# EAGLE design fancontrol (EAGLE 6.3)
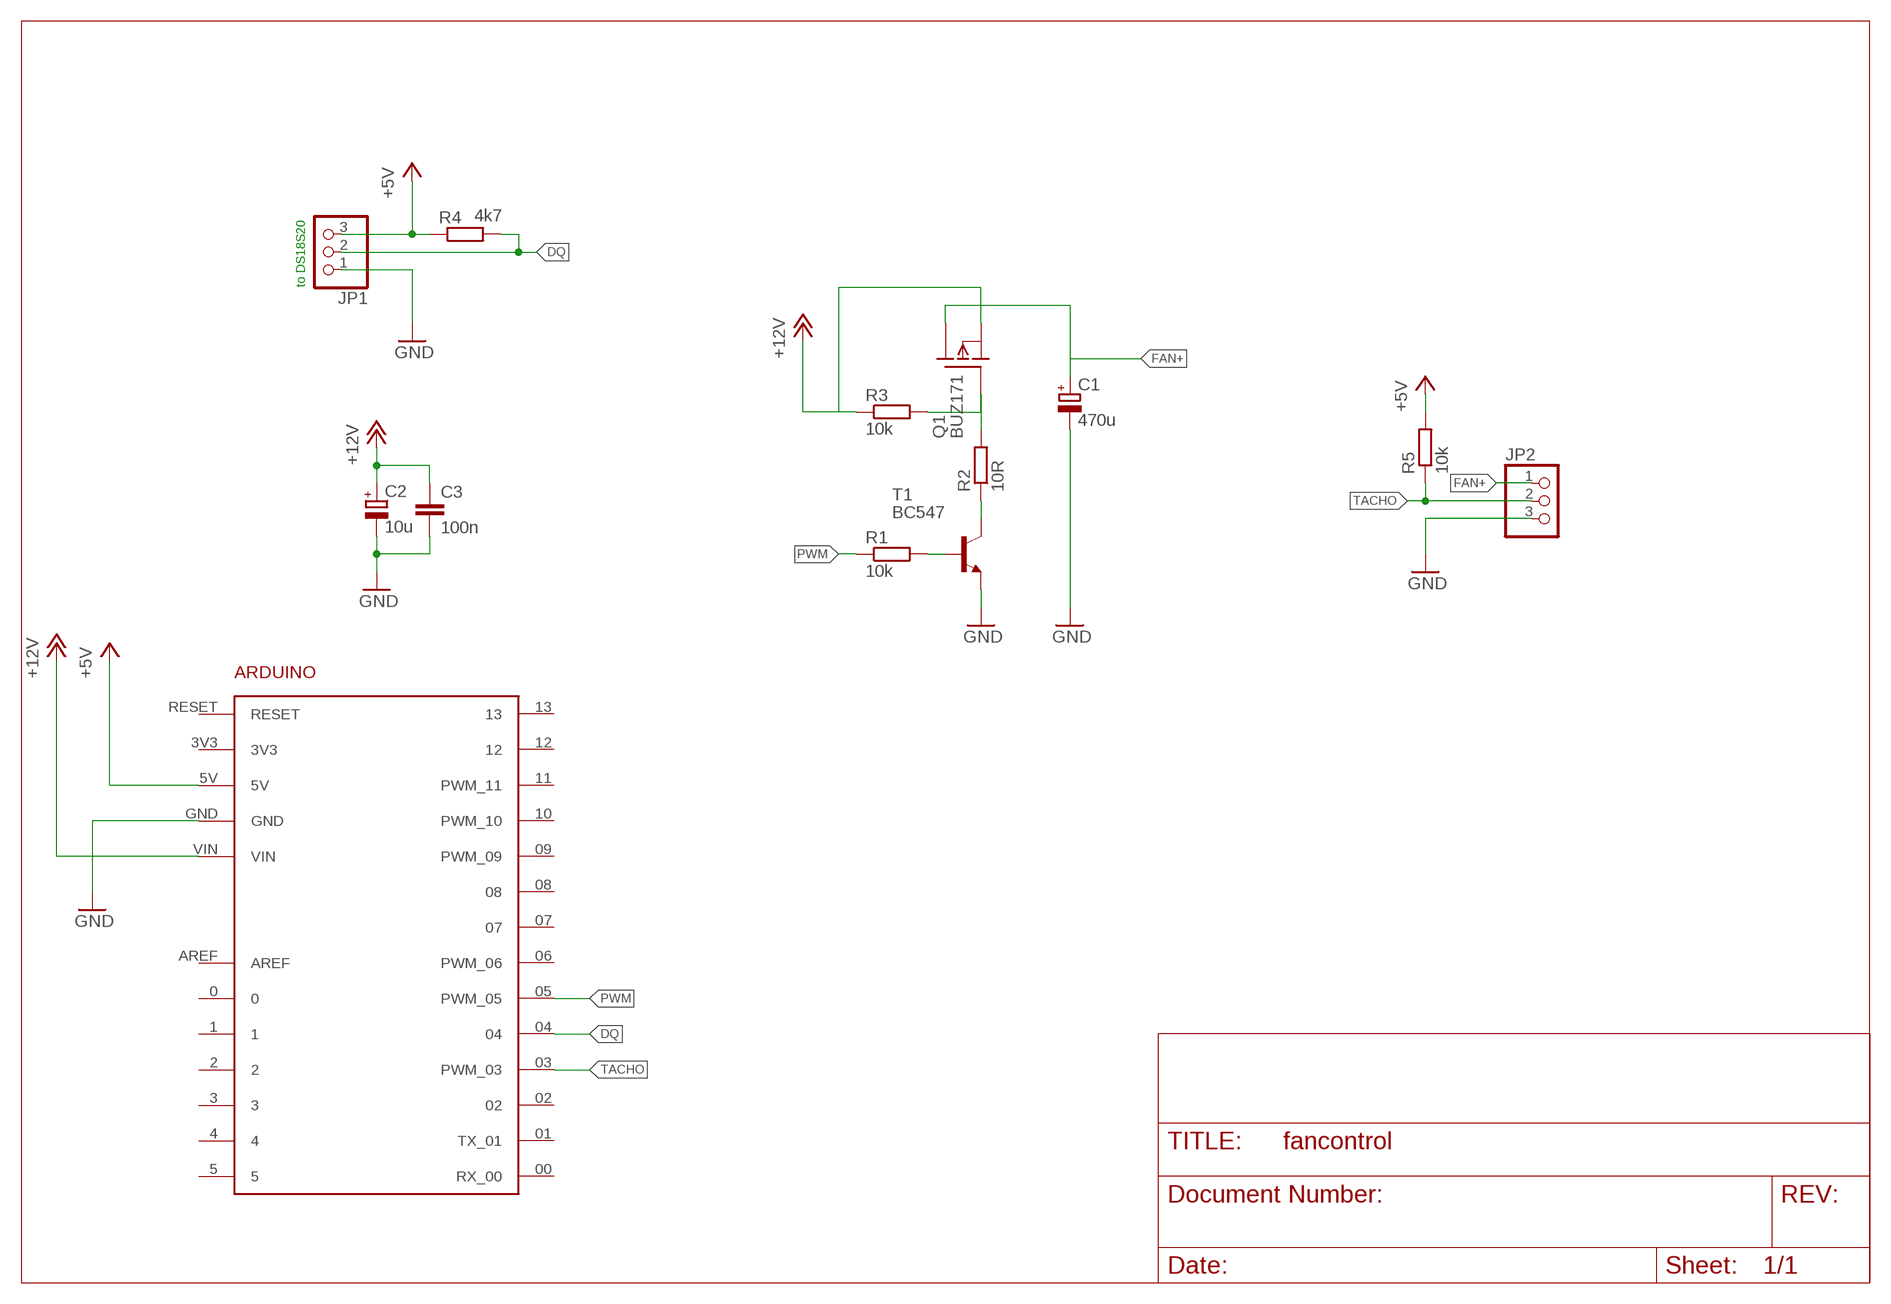
[diagram p0: schematic, sheet 1]

## Parts
ARDUINO1  ARDUINO  [ARDUINO]
C1  470u  CPOL-EUE5-10.5  [E5-10,5]
C2  10u  CPOL-EUE2.5-5  [E2,5-5]
C3  100n  C-EU025-025X050  [C025-025X050]
JP1  PINHD-1X3  [1X03]
JP2  PINHD-1X3  [1X03]
Q1  BUZ171  [TO220]
R1  10k  R-EU_0207/7  [0207/7]
R2  10R  R-EU_0207/7  [0207/7]
R3  10k  R-EU_0207/7  [0207/7]
R4  4k7  R-EU_0207/7  [0207/7]
R5  10k  R-EU_0207/7  [0207/7]
T1  BC547  [TO92]

## Nets
+5V: ARDUINO1.5V JP1.3 R4.1 R5.2
+12V: ARDUINO1.VIN C2.+ C3.1 Q1.3(S) R3.1
DQ: ARDUINO1.04 JP1.2 R4.2
FAN+: C1.+ JP2.1 Q1.2(D)
GND: ARDUINO1.GND C1.- C2.- C3.2 JP1.1 JP2.3 T1.1(E)
N$1: R1.2 T1.2(B)
N$2: R2.1 T1.3(C)
N$3: Q1.1(G) R2.2 R3.2
PWM: ARDUINO1.05(PWM_05) R1.1
TACHO: ARDUINO1.03(PWM_03) JP2.2 R5.1
Unconnected: ARDUINO1.0 ARDUINO1.00(RX_00) ARDUINO1.1 ARDUINO1.01(TX_01) ARDUINO1.02 ARDUINO1.2 ARDUINO1.3 ARDUINO1.3V3 ARDUINO1.4 ARDUINO1.5 ARDUINO1.06(PWM_06) ARDUINO1.07 ARDUINO1.08 ARDUINO1.09(PWM_09) ARDUINO1.10(PWM_10) ARDUINO1.11(PWM_11) ARDUINO1.12 ARDUINO1.13 ARDUINO1.AREF ARDUINO1.RESET

## Notes on the sheet
- to DS18S20

## Library data of the parts
ARDUINO1 = arduino:ARDUINO: For creating Arduino shields
C1 C2 = rcl:CPOL-EU: POLARIZED CAPACITOR, European symbol
C3 = rcl:C-EU: CAPACITOR, European symbol
JP1 JP2 = pinhead:PINHD-1X3: PIN HEADER
Q1 = transistor-fet:BUZ171: P-Channel Enhancement MOSFET -50V; 7A; 0,4Ohm
R1-R5 = rcl:R-EU_: RESISTOR, European symbol
T1 = transistor:BC547: NPN TRANSISTOR

## Board
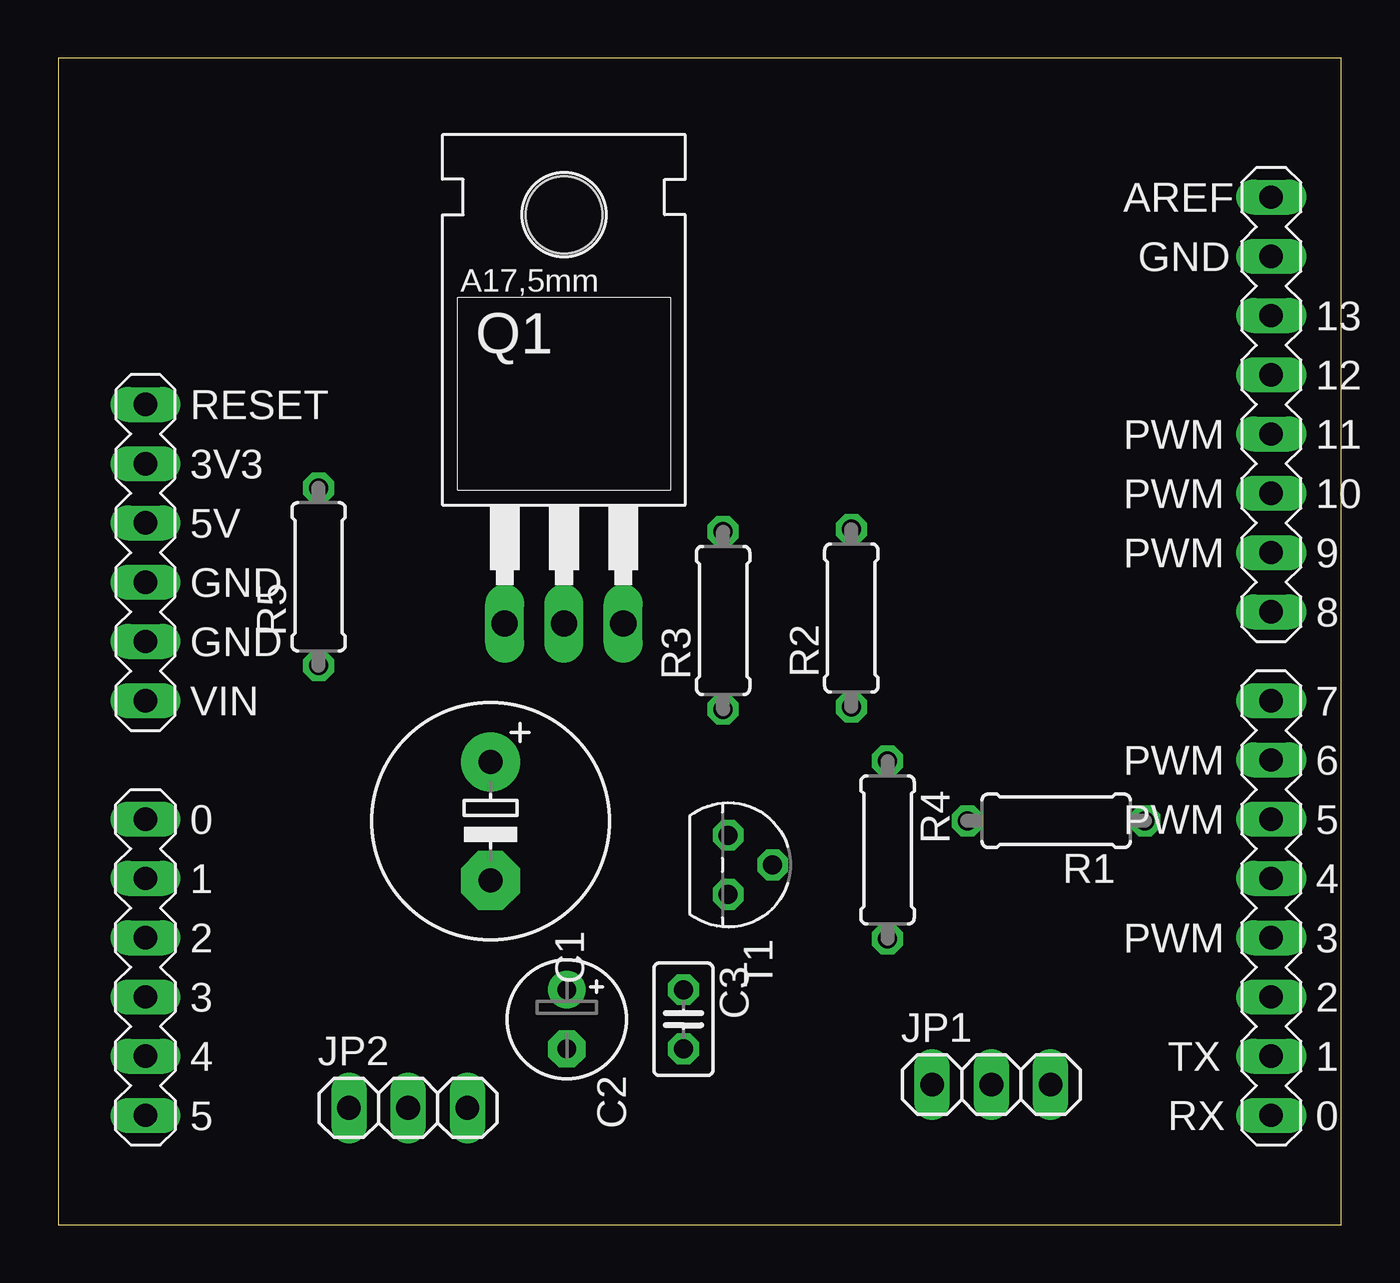
[diagram p1: board, top side]
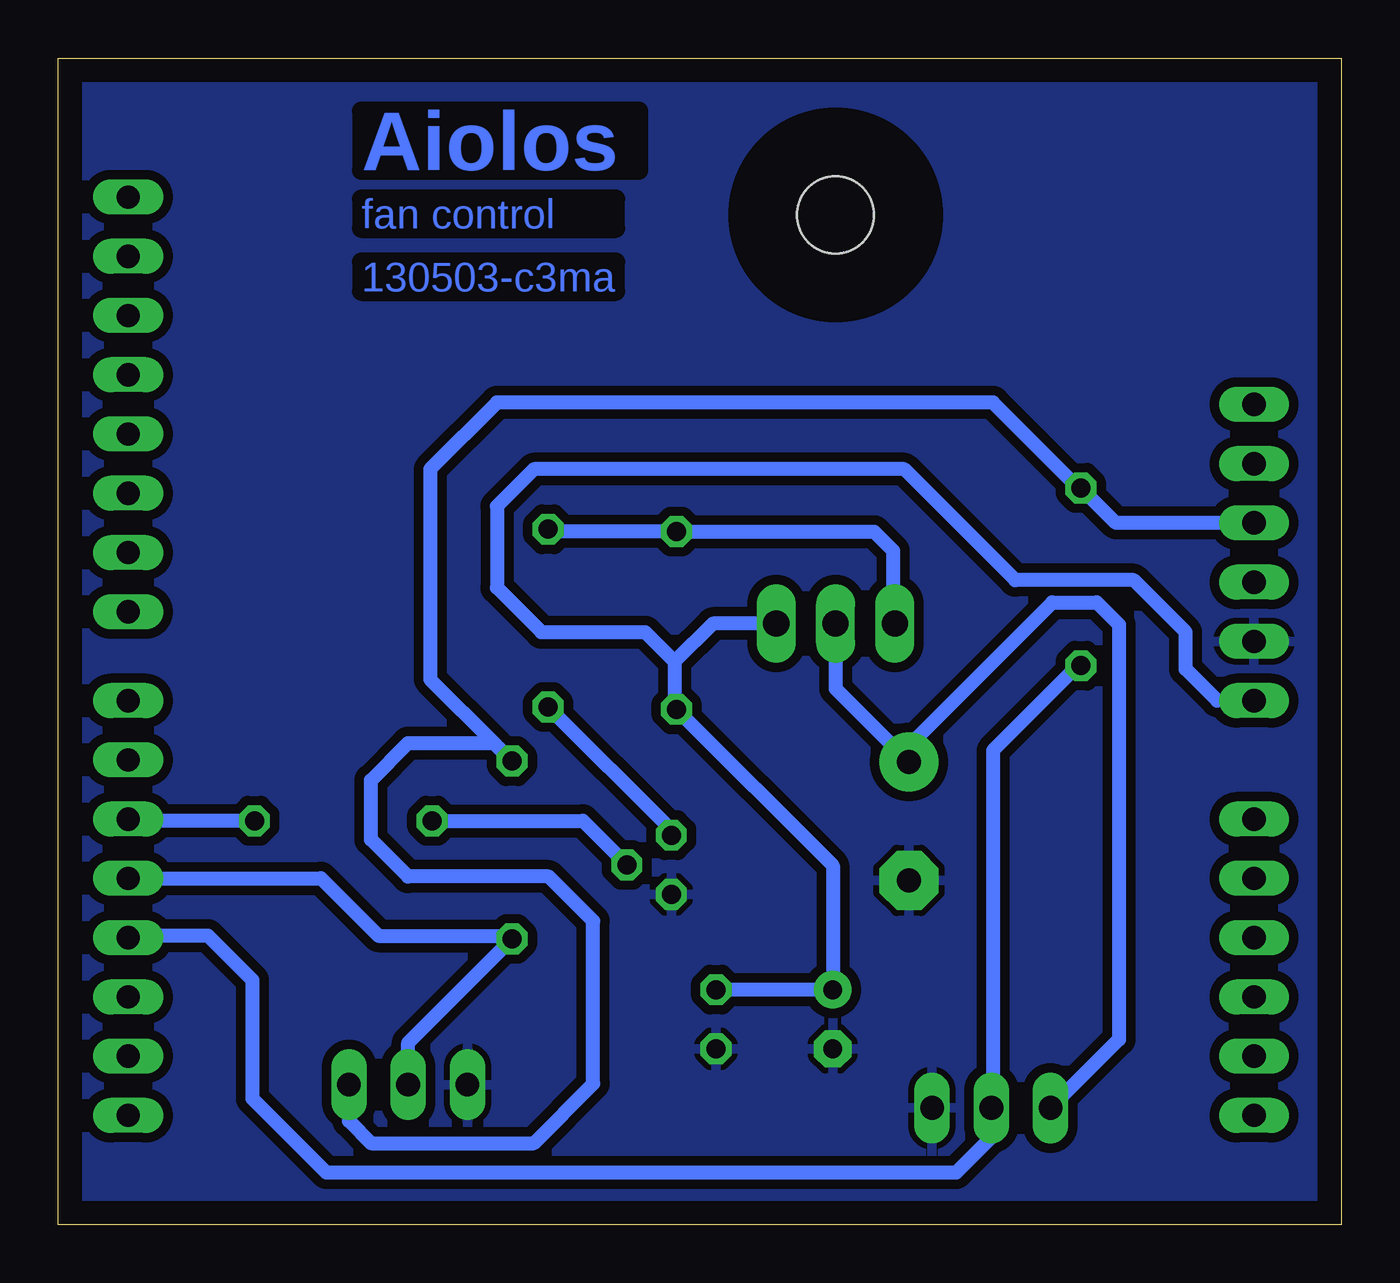
[diagram p2: board, bottom side, seen from below]

Size 55 x 50 mm. Coordinates in mm from the lower left corner, seen from the top.
Outline: 0,0 55,0 55,50 0,50 0,0
Copper layers (1*16): Top 0.035mm / dielectric 1.5mm / Bottom 0.035mm
Design rules "default": minimum track width 10mil, minimum drill 24mil, track to track 8mil, track to pad 8mil, pad to pad 8mil, via to via 8mil, smd to smd 8mil, copper to edge 40mil, drill to drill 8mil, minimum pad ring 10mil, minimum via ring 8mil, stop-mask expansion 4mil, vias tented up to drill 0mil, thermal gap 10mil

### Footprints (pad centres in the part's own frame; a part is rotated, then mirrored left to right if it is on the bottom)
ARDUINO = drill 1 long: 00 25.4,-20.32; 0 -22.86,-7.62; 01 25.4,-17.78; 1 -22.86,-10.16; 02 25.4,-15.24; 2 -22.86,-12.7; 03 25.4,-12.7; 3 -22.86,-15.24; 3V3 -22.86,7.62; 04 25.4,-10.16; 4 -22.86,-17.78; 05 25.4,-7.62; 5 -22.86,-20.32; 5V -22.86,5.08; 06 25.4,-5.08; 07 25.4,-2.54; 08 25.4,1.27; 09 25.4,3.81; 10 25.4,6.35; 11 25.4,8.89; 12 25.4,11.43; 13 25.4,13.97; AREF 25.4,19.05; GND -22.86,0; GND2 -22.86,2.54; GND3 25.4,16.51; RESET -22.86,10.16; VIN -22.86,-2.54
E5-10,5 = drill 1.016 pad 2.54: + -2.54,0 | drill 1.016 pad 2.54 octagon: - 2.54,0
E2,5-5 = drill 0.813 pad 1.6: + -1.27,0 | drill 0.813 pad 1.6 octagon: - 1.27,0
C025-025X050 = drill 0.813 octagon: 1 -1.27,0; 2 1.27,0
1X03 = drill 1.016 long: 1 -2.54,0; 2 0,0; 3 2.54,0
TO220 = drill 1.118 long: 1 -2.54,-6.35; 2 0,-6.35; 3 2.54,-6.35 | hole 3.302: 0,11.176
0207/7 = drill 0.813 octagon: 1 -3.81,0; 2 3.81,0
TO92 = drill 0.813 octagon: 1 1.27,0; 2 0,1.905; 3 -1.27,0

### Placement (x,y rotation side)
ARDUINO1  26.6,25 0 top
C1  18.53,17.29 270 top
C2  21.8,8.8 270 top
C3  26.8,8.8 270 top
JP1  40,6 0 top
JP2  15,5 0 top
Q1  21.68,32.12 0 top
R1  42.78,17.31 180 top
R2  34,26 90 top
R3  28.5,25.9 90 top
R4  35.55,16.06 270 top
R5  11.16,27.77 90 top
T1  28.72,15.42 270 top

### Tracks (layer width: path | path; a pad name or v marks a point on that pad's centre or on a via)
+5V
  Bottom 0.61: ARDUINO1.5V 9.66,30.08 R5.2 11.26,31.58 14.92,35.24 36.2,35.24 39.05,32.38 39.05,23.37 36.32,20.64 | JP1.3 42.54,4.44 41.59,3.49 34.61,3.49 32.07,6.03 32.07,13.02 33.97,14.92 40.01,14.92 41.59,16.51 41.59,19.05 40.01,20.64 36.32,20.64 | 36.32,20.64 36.1,20.42 R4.1
+12V
  Bottom 0.61: C3.1 C2.+ 21.8,15.39 R3.1 28.57,22.16 28.57,24.13 | Q1.3 26.94,25.77 28.57,24.13 | ARDUINO1.VIN 5.32,22.46 6.67,23.81 6.67,25.4 8.89,27.62 13.97,27.62 18.73,32.38 34.61,32.38 36.2,30.8 36.2,27.3 34.29,25.4 29.84,25.4 28.57,24.13
DQ
  Bottom 0.61: JP1.2 40,7.8 R4.2 35.68,12.38 41.27,12.38 43.73,14.84 ARDUINO1.04
FAN+
  Bottom 0.61: Q1.2 21.68,22.98 C1.+ 18.53,20.52 12.38,26.67 10.48,26.67 9.53,25.72 9.53,7.93 JP2.1
GND
  pour Bottom (isolate 0.406): 0,0 55,0 55,50 0,50
N$1
  Bottom 0.61: R1.2 32.51,17.31 T1.2
N$2
  Bottom 0.406: 34,21.97 R2.1
  Bottom 0.61: T1.3 28.72,16.91 R2.1
N$3
  Bottom 0.61: R2.2 33.9,29.71 R3.2 20.03,29.71 19.21,28.89 19.21,26.79 Q1.1
PWM
  Bottom 0.61: R1.1 51.93,17.31 ARDUINO1.05
TACHO
  Bottom 0.61: ARDUINO1.03 51.92,12.38 48.58,12.38 46.67,10.48 46.67,5.4 43.5,2.22 16.51,2.22 15,3.73 JP2.2 14.92,5.08 14.92,20.32 11.28,23.96 R5.1

### Text on the board
Bottom: Aiolos | fan control | 130503-c3ma